# EAGLE schematic 1tm32 (EAGLE 9.6.2)
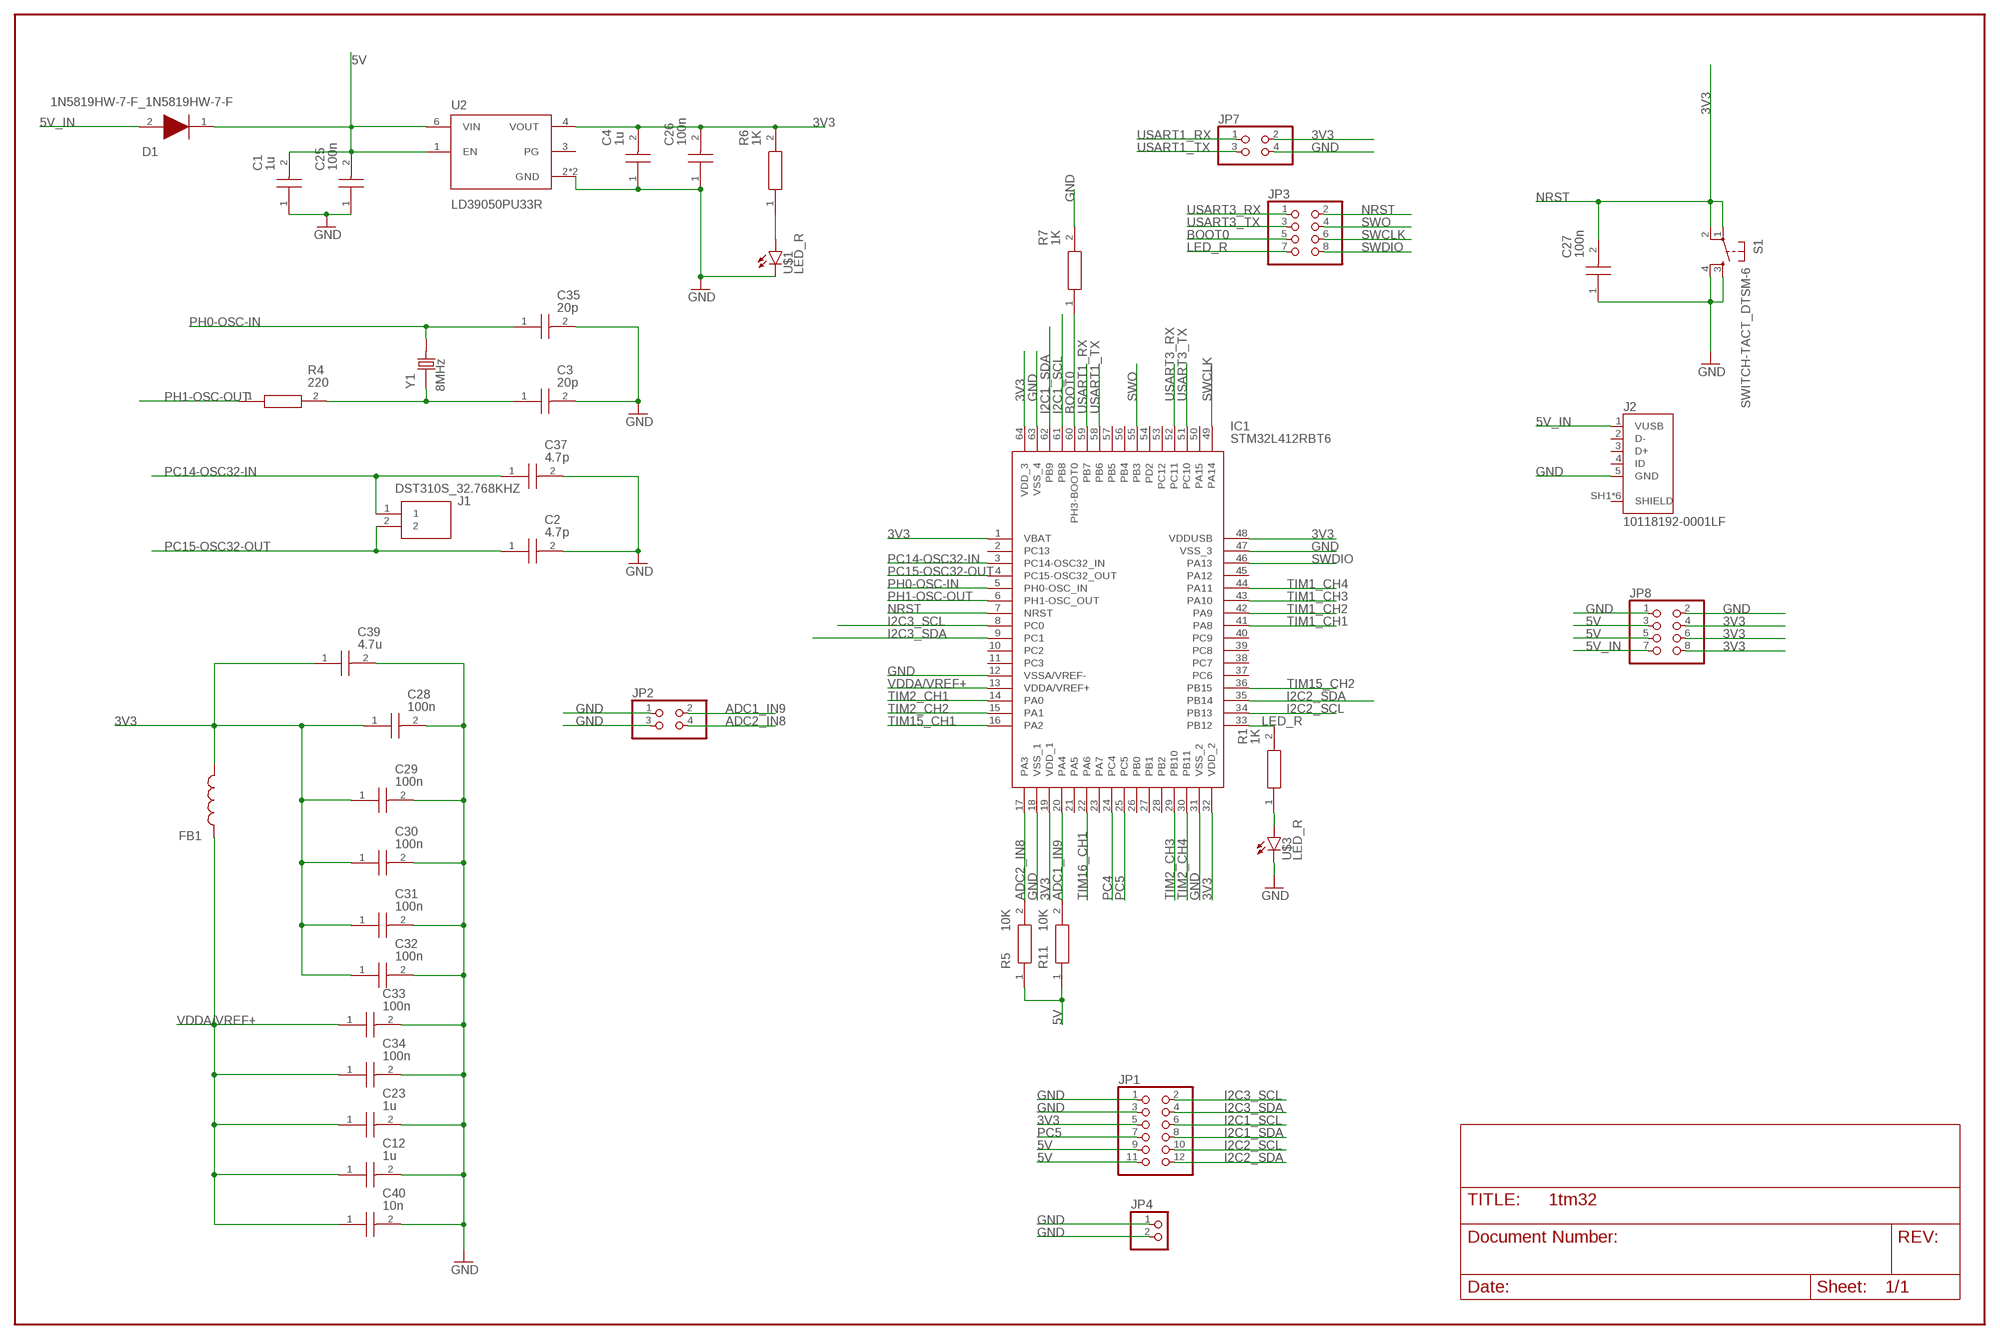
[diagram p0: schematic, sheet 1]

## Parts
C1  1u  GRM219R61H105KA73D  [CAPC2012X95N]
C2  4.7p  GQM2195C2E4R7BB12D  [CAPC2012X100N]
C3  20p  CC0402KPX7R7BB104  [CAPC1005X55N]
C4  1u  GRM219R61H105KA73D  [CAPC2012X95N]
C12  1u  GRM219R61H105KA73D  [CAPC2012X95N]
C23  1u  GRM219R61H105KA73D  [CAPC2012X95N]
C25  100n  GRT31C5C2A104JA12L  [CAPC3216X180N]
C26  100n  GRT31C5C2A104JA12L  [CAPC3216X180N]
C27  100n  GRT31C5C2A104JA12L  [CAPC3216X180N]
C28  100n  GRT31C5C2A104JA12L  [CAPC3216X180N]
C29  100n  GRT31C5C2A104JA12L  [CAPC3216X180N]
C30  100n  GRT31C5C2A104JA12L  [CAPC3216X180N]
C31  100n  GRT31C5C2A104JA12L  [CAPC3216X180N]
C32  100n  GRT31C5C2A104JA12L  [CAPC3216X180N]
C33  100n  GRT31C5C2A104JA12L  [CAPC3216X180N]
C34  100n  GRT31C5C2A104JA12L  [CAPC3216X180N]
C35  20p  CC0402KPX7R7BB104  [CAPC1005X55N]
C37  4.7p  GQM2195C2E4R7BB12D  [CAPC2012X100N]
C39  4.7u  GRT21BC71H475KE13L  [CAPC2012X145N]
C40  10n  GRM31CR73A103KW03L  [CAPC3216X180N]
D1  1N5819HW-7-F_1N5819HW-7-F  [1N5819HW-7-F_SOD3716X145N]
FB1  BK1608HS601-T  [BEADC1608X95N]
IC1  STM32L412RBT6  STM32L412RBT6P  [QFP50P1200X1200X160-64N]
J1  DST310S_32.768KHZ  DST310S_32.768KHZ_DST310S_32.768KHZ  [DST310S_32.768KHZ_DST310S32768KHZ]
J2  10118192-0001LF  [AMPHENOL_10118192-0001LF]
JP1  PINHD-2X6  [2X06]
JP2  PINHD-2X2  [2X02]
JP3  PINHD-2X4  [2X04]
JP4  PINHD-1X2  [1X02]
JP7  PINHD-2X2  [2X02]
JP8  PINHD-2X4  [2X04]
R1  1K  RC0805FR-131KL  [RESC2012X60N]
R4  220  RC0805FR-10220RL  [RESC2012X60N]
R5  10K  RC0805JR-0710KL  [RESC2012X60N]
R6  1K  RC0805FR-131KL  [RESC2012X60N]
R7  1K  RC0805FR-131KL  [RESC2012X60N]
R11  10K  RC0805JR-0710KL  [RESC2012X60N]
S1  SWITCH-TACT_DTSM-6  [SWITCH-TACT_DTSM-6]
U2  LD39050PU33R  [SON95P300X300X100-7N]
U$1  LED_R  SML-P12VTT86  [LED_SML-P11UTT86R]
U$3  LED_R  SML-P12VTT86  [LED_SML-P11UTT86R]
Y1  8MHz  ABLS-8.000MHZ-B2-T  [XTAL_ABLS-8.000MHZ-B2-T]

## Nets
3V3: C4.2 C26.2 C28.1 C29.1 C30.1 C31.1 C32.1 C39.1 FB1.2 IC1.1(VBAT) IC1.19(VDD_1) IC1.32(VDD_2) IC1.48(VDDUSB) IC1.64(VDD_3) JP1.5 JP7.2 JP8.4 JP8.6 JP8.8 R6.2 U2.4(VOUT)
5V: C1.2 C25.2 D1.1(K) JP1.9 JP1.11 JP8.3 JP8.5 R5.1 R11.1 U2.1(EN) U2.6(VIN)
5V_IN: D1.2(A) J2.1(VUSB) JP8.7
ADC1_IN9: IC1.20(PA4) JP2.2 R11.2
ADC2_IN8: IC1.17(PA3) JP2.4 R5.2
BOOT0: IC1.60(PH3-BOOT0) JP3.5 R7.1
GND: C1.1 C2.2 C3.2 C4.1 C12.2 C23.2 C25.1 C26.1 C27.1 C28.2 C29.2 C30.2 C31.2 C32.2 C33.2 C34.2 C35.2 C37.2 C39.2 C40.2 IC1.12(VSSA/VREF-) IC1.18(VSS_1) IC1.31(VSS_2) IC1.47(VSS_3) IC1.63(VSS_4) J2.5(GND) JP1.1 JP1.3 JP2.1 JP2.3 JP4.1 JP4.2 JP7.4 JP8.1 JP8.2 R7.2 S1.3 S1.4 U2.2(GND) U2.7(GND) U$1.C U$3.C
I2C1_SCL: IC1.61(PB8) JP1.6
I2C1_SDA: IC1.62(PB9) JP1.8
I2C2_SCL: IC1.34(PB13) JP1.10
I2C2_SDA: IC1.35(PB14) JP1.12
I2C3_SCL: IC1.8(PC0) JP1.2
I2C3_SDA: IC1.9(PC1) JP1.4
LED_R: IC1.33(PB12) JP3.7 R1.2
N$2: R1.1 U$3.A
N$3: C3.1 R4.2 Y1.1
N$5: R6.1 U$1.A
NRST: C27.2 IC1.7(NRST) JP3.2 S1.1 S1.2
PC4: IC1.24(PC4)
PC5: IC1.25(PC5) JP1.7
PC14-OSC32-IN: C37.1 IC1.3(PC14-OSC32_IN) J1.1
PC15-OSC32-OUT: C2.1 IC1.4(PC15-OSC32_OUT) J1.2
PH0-OSC-IN: C35.1 IC1.5(PH0-OSC_IN) Y1.2
PH1-OSC-OUT: IC1.6(PH1-OSC_OUT) R4.1
SWCLK: IC1.49(PA14) JP3.6
SWDIO: IC1.46(PA13) JP3.8
SWO: IC1.55(PB3) JP3.4
TIM1_CH1: IC1.41(PA8)
TIM1_CH2: IC1.42(PA9)
TIM1_CH3: IC1.43(PA10)
TIM1_CH4: IC1.44(PA11)
TIM2_CH1: IC1.14(PA0)
TIM2_CH2: IC1.15(PA1)
TIM2_CH3: IC1.29(PB10)
TIM2_CH4: IC1.30(PB11)
TIM15_CH1: IC1.16(PA2)
TIM15_CH2: IC1.36(PB15)
TIM16_CH1: IC1.22(PA6)
USART1_RX: IC1.59(PB7) JP7.1
USART1_TX: IC1.58(PB6) JP7.3
USART3_RX: IC1.52(PC11) JP3.1
USART3_TX: IC1.51(PC10) JP3.3
VDDA/VREF+: C12.1 C23.1 C33.1 C34.1 C40.1 FB1.1 IC1.13(VDDA/VREF+)
Unconnected: IC1.2(PC13) IC1.10(PC2) IC1.11(PC3) IC1.21(PA5) IC1.23(PA7) IC1.26(PB0) IC1.27(PB1) IC1.28(PB2) IC1.37(PC6) IC1.38(PC7) IC1.39(PC8) IC1.40(PC9) IC1.45(PA12) IC1.50(PA15) IC1.53(PC12) IC1.54(PD2) IC1.56(PB4) IC1.57(PB5) J2.2(D-) J2.3(D+) J2.4(ID) J2.SH1(SHIELD) J2.SH2(SHIELD) J2.SH3(SHIELD) J2.SH4(SHIELD) J2.SH5(SHIELD) J2.SH6(SHIELD) U2.3(PG)

## Library data of the parts
C1 C4 C12 C23 = GRM219R61H105KA73D(1u):GRM219R61H105KA73D: MURATA - GRM219R61H105KA73D - CAP, MLCC, X5R, 1UF, 50V, 0805 Source: Datasheet <https://datasheet.datasheetarchive.com/originals/distributors/DKDS-10/191852.pdf>; DESCRIPTION: MURATA - GRM219R61H105KA73D - CAP, MLCC, X5R, 1UF, 50V, 0805; HEIGHT: 0.95mm; MANUFACTURER_NAME: Murata Electronics; MANUFACTURER_PART_NUMBER: GRM219R61H105KA73D; MOUSER_PART_NUMBER: 81-GRM219R61H105KA3D; MOUSER_PRICE-STOCK: https://www.mouser.co.uk/ProductDetail/Murata-Electronics/GRM219R61H105KA73D?qs=O5cugoO6nweiD1nCQ5vS9w%3D%3D
C2 C37 = GQM2195C2E4R7BB12D(4_7p):GQM2195C2E4R7BB12D: Capacitor GQM21 L=2.0mm W=1.25mm T=0.85mm Source: Datasheet <https://psearch.en.murata.com/capacitor/product/GQM2195C2E4R7BB12#.html>; DESCRIPTION: Capacitor GQM21 L=2.0mm W=1.25mm T=0.85mm; HEIGHT: 1mm; MANUFACTURER_NAME: Murata Electronics; MANUFACTURER_PART_NUMBER: GQM2195C2E4R7BB12D; MOUSER_PART_NUMBER: 81-GQM2195C2E4R7BB2D; MOUSER_PRICE-STOCK: https://www.mouser.co.uk/ProductDetail/Murata-Electronics/GQM2195C2E4R7BB12D?qs=0JbGSuRBwBOIE8NOw5EJ%2FA%3D%3D
C3 C35 = CC0402KPX7R7BB104(0402cap_foot):CC0402KPX7R7BB104: Multilayer Ceramic Capacitors MLCC - SMD/SMT 16 V 0.1uF X7R 0402 10% Source: Datasheet <https://www.mouser.ca/datasheet/2/447/UPY_NP0X5R_01005_4V_to_25V_V10-3003057.pdf>; DESCRIPTION: Multilayer Ceramic Capacitors MLCC - SMD/SMT 16 V 0.1uF X7R 0402 10%; HEIGHT: 0.55mm; MANUFACTURER_NAME: YAGEO; MANUFACTURER_PART_NUMBER: CC0402KPX7R7BB104; MOUSER_PART_NUMBER: 603-CC402KPX7R7BB104; MOUSER_PRICE-STOCK: https://www.mouser.co.uk/ProductDetail/YAGEO/CC0402KPX7R7BB104?qs=7s%252B3O6pAiyDFg2%2FesnFI7w%3D%3D
C25-C34 = GRT31C5C2A104JA12L(0_1u):GRT31C5C2A104JA12L: Multilayer Ceramic Capacitors MLCC - SMD/SMT Source: Datasheet <https://www.murata.com/en-eu/products/productdetail?partno=GRT31C5C2A104JA12#>; DESCRIPTION: Multilayer Ceramic Capacitors MLCC - SMD/SMT; HEIGHT: 1.8mm; MANUFACTURER_NAME: Murata Electronics; MANUFACTURER_PART_NUMBER: GRT31C5C2A104JA12L; MOUSER_PART_NUMBER: 81-GRT31C5C2A104JA2L; MOUSER_PRICE-STOCK: https://www.mouser.co.uk/ProductDetail/Murata-Electronics/GRT31C5C2A104JA12L?qs=rI7uf1IzohSpYGEFBFd58g%3D%3D
C39 = GRT21BC71H475KE13L(4_7u):GRT21BC71H475KE13L: GRT21BC71H475KE13_ (0805, X7S:EIA, 4.7uF, DC50V) Source: Datasheet <https://search.murata.co.jp/Ceramy/image/img/A01X/G101/ENG/GRT21BC71H475KE13-01.pdf>; DESCRIPTION: GRT21BC71H475KE13_ (0805, X7S:EIA, 4.7uF, DC50V); HEIGHT: 1.45mm; MANUFACTURER_NAME: Murata Electronics; MANUFACTURER_PART_NUMBER: GRT21BC71H475KE13L; MOUSER_PART_NUMBER: 81-GRT21BC71H475KE3L; MOUSER_PRICE-STOCK: https://www.mouser.co.uk/ProductDetail/Murata-Electronics/GRT21BC71H475KE13L?qs=rI7uf1IzohQrtwc9u30k7A%3D%3D
C40 = GRM31CR73A103KW03L(0_01u):GRM31CR73A103KW03L: Murata 3216 GRM 10000pF Ceramic Multilayer Capacitor, 1000 V dc, +125C, X7R Dielectric, +/-10% Source: Datasheet <https://datasheet.datasheetarchive.com/originals/distributors/DKDS-10/192419.pdf>; DESCRIPTION: Murata 3216 GRM 10000pF Ceramic Multilayer Capacitor, 1000 V dc, +125C, X7R Dielectric, +/-10%; HEIGHT: 1.8mm; MANUFACTURER_NAME: Murata Electronics; MANUFACTURER_PART_NUMBER: GRM31CR73A103KW03L; MOUSER_PART_NUMBER: 81-GRM31CR73A103KW3L; MOUSER_PRICE-STOCK: https://www.mouser.co.uk/ProductDetail/Murata-Electronics/GRM31CR73A103KW03L?qs=hNud%2FORuBR1TymPCs4fJcA%3D%3D
D1 = ce-capstone-2022:1N5819HW-7-F_1N5819HW-7-F: Diode Schottky 1A 40V SOD123 Diodes Inc 1N5819HW-7-F, SMT Schottky Diode, 40V 1A, 2-Pin SOD-123 Source: Datasheet <https://datasheet.datasheetarchive.com/originals/distributors/Datasheets-DGA23/1390892.pdf>; ARROW_PART_NUMBER: 1N5819HW-7-F; ARROW_PRICE-STOCK: https://www.arrow.com/en/products/1n5819hw-7-f/diodes-incorporated; DESCRIPTION: Diode Schottky 1A 40V SOD123 Diodes Inc 1N5819HW-7-F, SMT Schottky Diode, 40V 1A, 2-Pin SOD-123; HEIGHT: 1.45mm; MANUFACTURER_NAME: Diodes Inc.; MANUFACTURER_PART_NUMBER: 1N5819HW-7-F; MOUSER_PART_NUMBER: 621-1N5819HW-F; MOUSER_PRICE-STOCK: https://www.mouser.co.uk/ProductDetail/Diodes-Incorporated/1N5819HW-7-F?qs=NQ47qNm99eDyWTEd07miYA%3D%3D
FB1 = ce-capstone:BK1608HS601-T: Ferrite Chip Bead(Lead Free) Source: Datasheet <https://www.tai-tech.com.tw/_upload/files/FCM1608-Series.pdf>; DESCRIPTION: Ferrite Chip Bead(Lead Free); HEIGHT: 0.95mm; MANUFACTURER_NAME: Taiyo Yuden; MANUFACTURER_PART_NUMBER: BK1608HS601-T
IC1 = STM32L412RBT6P:STM32L412RBT6P: ARM Microcontrollers - MCU Source: Datasheet <https://www.st.com/resource/en/datasheet/stm32l412c8.pdf>; DESCRIPTION: ARM Microcontrollers - MCU; HEIGHT: 1.6mm; MANUFACTURER_NAME: STMicroelectronics; MANUFACTURER_PART_NUMBER: STM32L412RBT6P; MOUSER_PART_NUMBER: 511-STM32L412RBT6P; MOUSER_PRICE-STOCK: https://www.mouser.co.uk/ProductDetail/STMicroelectronics/STM32L412RBT6P?qs=l7cgNqFNU1hh%252BU1wOZs5Xg%3D%3D
J1 = ce-capstone-2022:DST310S_32.768KHZ_DST310S_32.768KHZ: SMD Crystal Resonators 32.768KHz +/-20ppm SMD-3215_2P RoHS Source: Datasheet <https://datasheet.lcsc.com/szlcsc/KDS-Daishinku-KDS-32-768KHz-12-5PF-20ppm_C93232.pdf>; DESCRIPTION: SMD Crystal Resonators 32.768KHz +/-20ppm SMD-3215_2P RoHS; HEIGHT: 0.85mm; MANUFACTURER_NAME: KDS Daishinku; MANUFACTURER_PART_NUMBER: DST310S 32.768KHz
J2 = ce-capstone:10118192-0001LF: Single Port 5 Contact Horizontal Right Angle Shielded Micro B USB 2.0 Connector; AVAILABILITY: Unavailable; DESCRIPTION: USB - micro B USB 2.0 Receptacle Connector 5 Position Surface Mount, Right Angle; MF: Amphenol ICC; MP: 10118192-0001LF; PACKAGE: None; PRICE: None
JP1 = pinhead:PINHD-2X6: PIN HEADER
JP2 JP7 = pinhead:PINHD-2X2: PIN HEADER
JP3 JP8 = pinhead:PINHD-2X4: PIN HEADER
JP4 = pinhead:PINHD-1X2: PIN HEADER
R1 R6 R7 = RC0805FR-131KL:RC0805FR-131KL: Thick Film Resistors - SMD 1 kOhms 250 mW 0805 1% Source: Datasheet <https://datasheet.datasheetarchive.com/originals/distributors/Datasheets_SAMA/902f9e387b938f871d31120f5fc1d65e.pdf>; DESCRIPTION: Thick Film Resistors - SMD 1 kOhms 250 mW 0805 1%; HEIGHT: 0.6mm; MANUFACTURER_NAME: KEMET; MANUFACTURER_PART_NUMBER: RC0805FR-131KL; MOUSER_PART_NUMBER: 603-RC0805FR-131KL; MOUSER_PRICE-STOCK: https://www.mouser.co.uk/ProductDetail/YAGEO/RC0805FR-131KL?qs=m6lXFsvg5e0qJLgmV7HC3Q%3D%3D
R4 = RC0805FR-10220RL:RC0805FR-10220RL: Thick Film Resistors - SMD 220 OHM 1% Source: Datasheet; DESCRIPTION: Thick Film Resistors - SMD 220 OHM 1%; HEIGHT: 0.6mm; MANUFACTURER_NAME: KEMET; MANUFACTURER_PART_NUMBER: RC0805FR-10220RL; MOUSER_PART_NUMBER: 603-RC0805FR-10220RL; MOUSER_PRICE-STOCK: https://www.mouser.co.uk/ProductDetail/YAGEO/RC0805FR-10220RL?qs=m6lXFsvg5e0JpfeoSKi9%252BQ%3D%3D
R5 R11 = RC0805JR-0710KL:RC0805JR-0710KL: YAGEO - RC0805JR-0710KL - SMD Chip Resistor, 0805 [2012 Metric], 10 kohm, RC Series, 150 V, Thick Film, 125 mW Source: Datasheet <https://datasheet.datasheetarchive.com/originals/distributors/Datasheets_SAMA/902f9e387b938f871d31120f5fc1d65e.pdf>; DESCRIPTION: YAGEO - RC0805JR-0710KL - SMD Chip Resistor, 0805 [2012 Metric], 10 kohm, RC Series, 150 V, Thick Film, 125 mW; HEIGHT: 0.6mm; MANUFACTURER_NAME: KEMET; MANUFACTURER_PART_NUMBER: RC0805JR-0710KL; MOUSER_PART_NUMBER: 603-RC0805JR-0710KL; MOUSER_PRICE-STOCK: https://www.mouser.co.uk/ProductDetail/YAGEO/RC0805JR-0710KL?qs=ZFGQJeMQzF5q%2Fp77vM%2FrVQ%3D%3D
S1 = ce-capstone-2022:SWITCH-TACT_DTSM-6
U2 = ce-capstone:LD39050PU33R: LD39050 Series 500 mA 3.3 V Fixed Low Noise LDO Voltage Regulator - DFN-6; AVAILABILITY: Unavailable; DESCRIPTION: Linear Voltage Regulator IC 1 Output 500mA 6-DFN _3x3_; MF: STMicroelectronics; MP: LD39050PU33R; PACKAGE: DFN-6 STMicroelectronics; PRICE: None
U$1 U$3 = ce-capstone:SML-P12VTT86: SML-P1 Series Red 0402 Clear 60 mcd 2 V Surface Mount PICOLED LED; AVAILABILITY: Unavailable; DESCRIPTION: Red 630nm LED Indication - Discrete 2V 0402 _1006 Metric_; MF: Rohm; MP: SML-P12VTT86; PACKAGE: 0402 Rohm; PRICE: None
Y1 = ce-capstone:ABLS-8.000MHZ-B2-T: Crystal 8MHz Â±20ppm (Tol) Â±50ppm (Stability) 18pF FUND 80Ohm 2-Pin HC-49/US SMD T/R; AVAILABILITY: Unavailable; DESCRIPTION: 8MHz ±20ppm Crystal 18pF 80 Ohms HC-49/US; MF: Abracon LLC; MP: ABLS-8.000MHZ-B2; PACKAGE: HC-49/US Abracon LLC; PRICE: None